# EasyEDA schematic Skematic.json
TITLE: DIGITAL_CLOCK (GIFT); REV: 1.0; Date: 2025-07-25; Sheet: 1/1; Drawn By: TONY HUYNH TRAN; Company: TONY COOPERATION
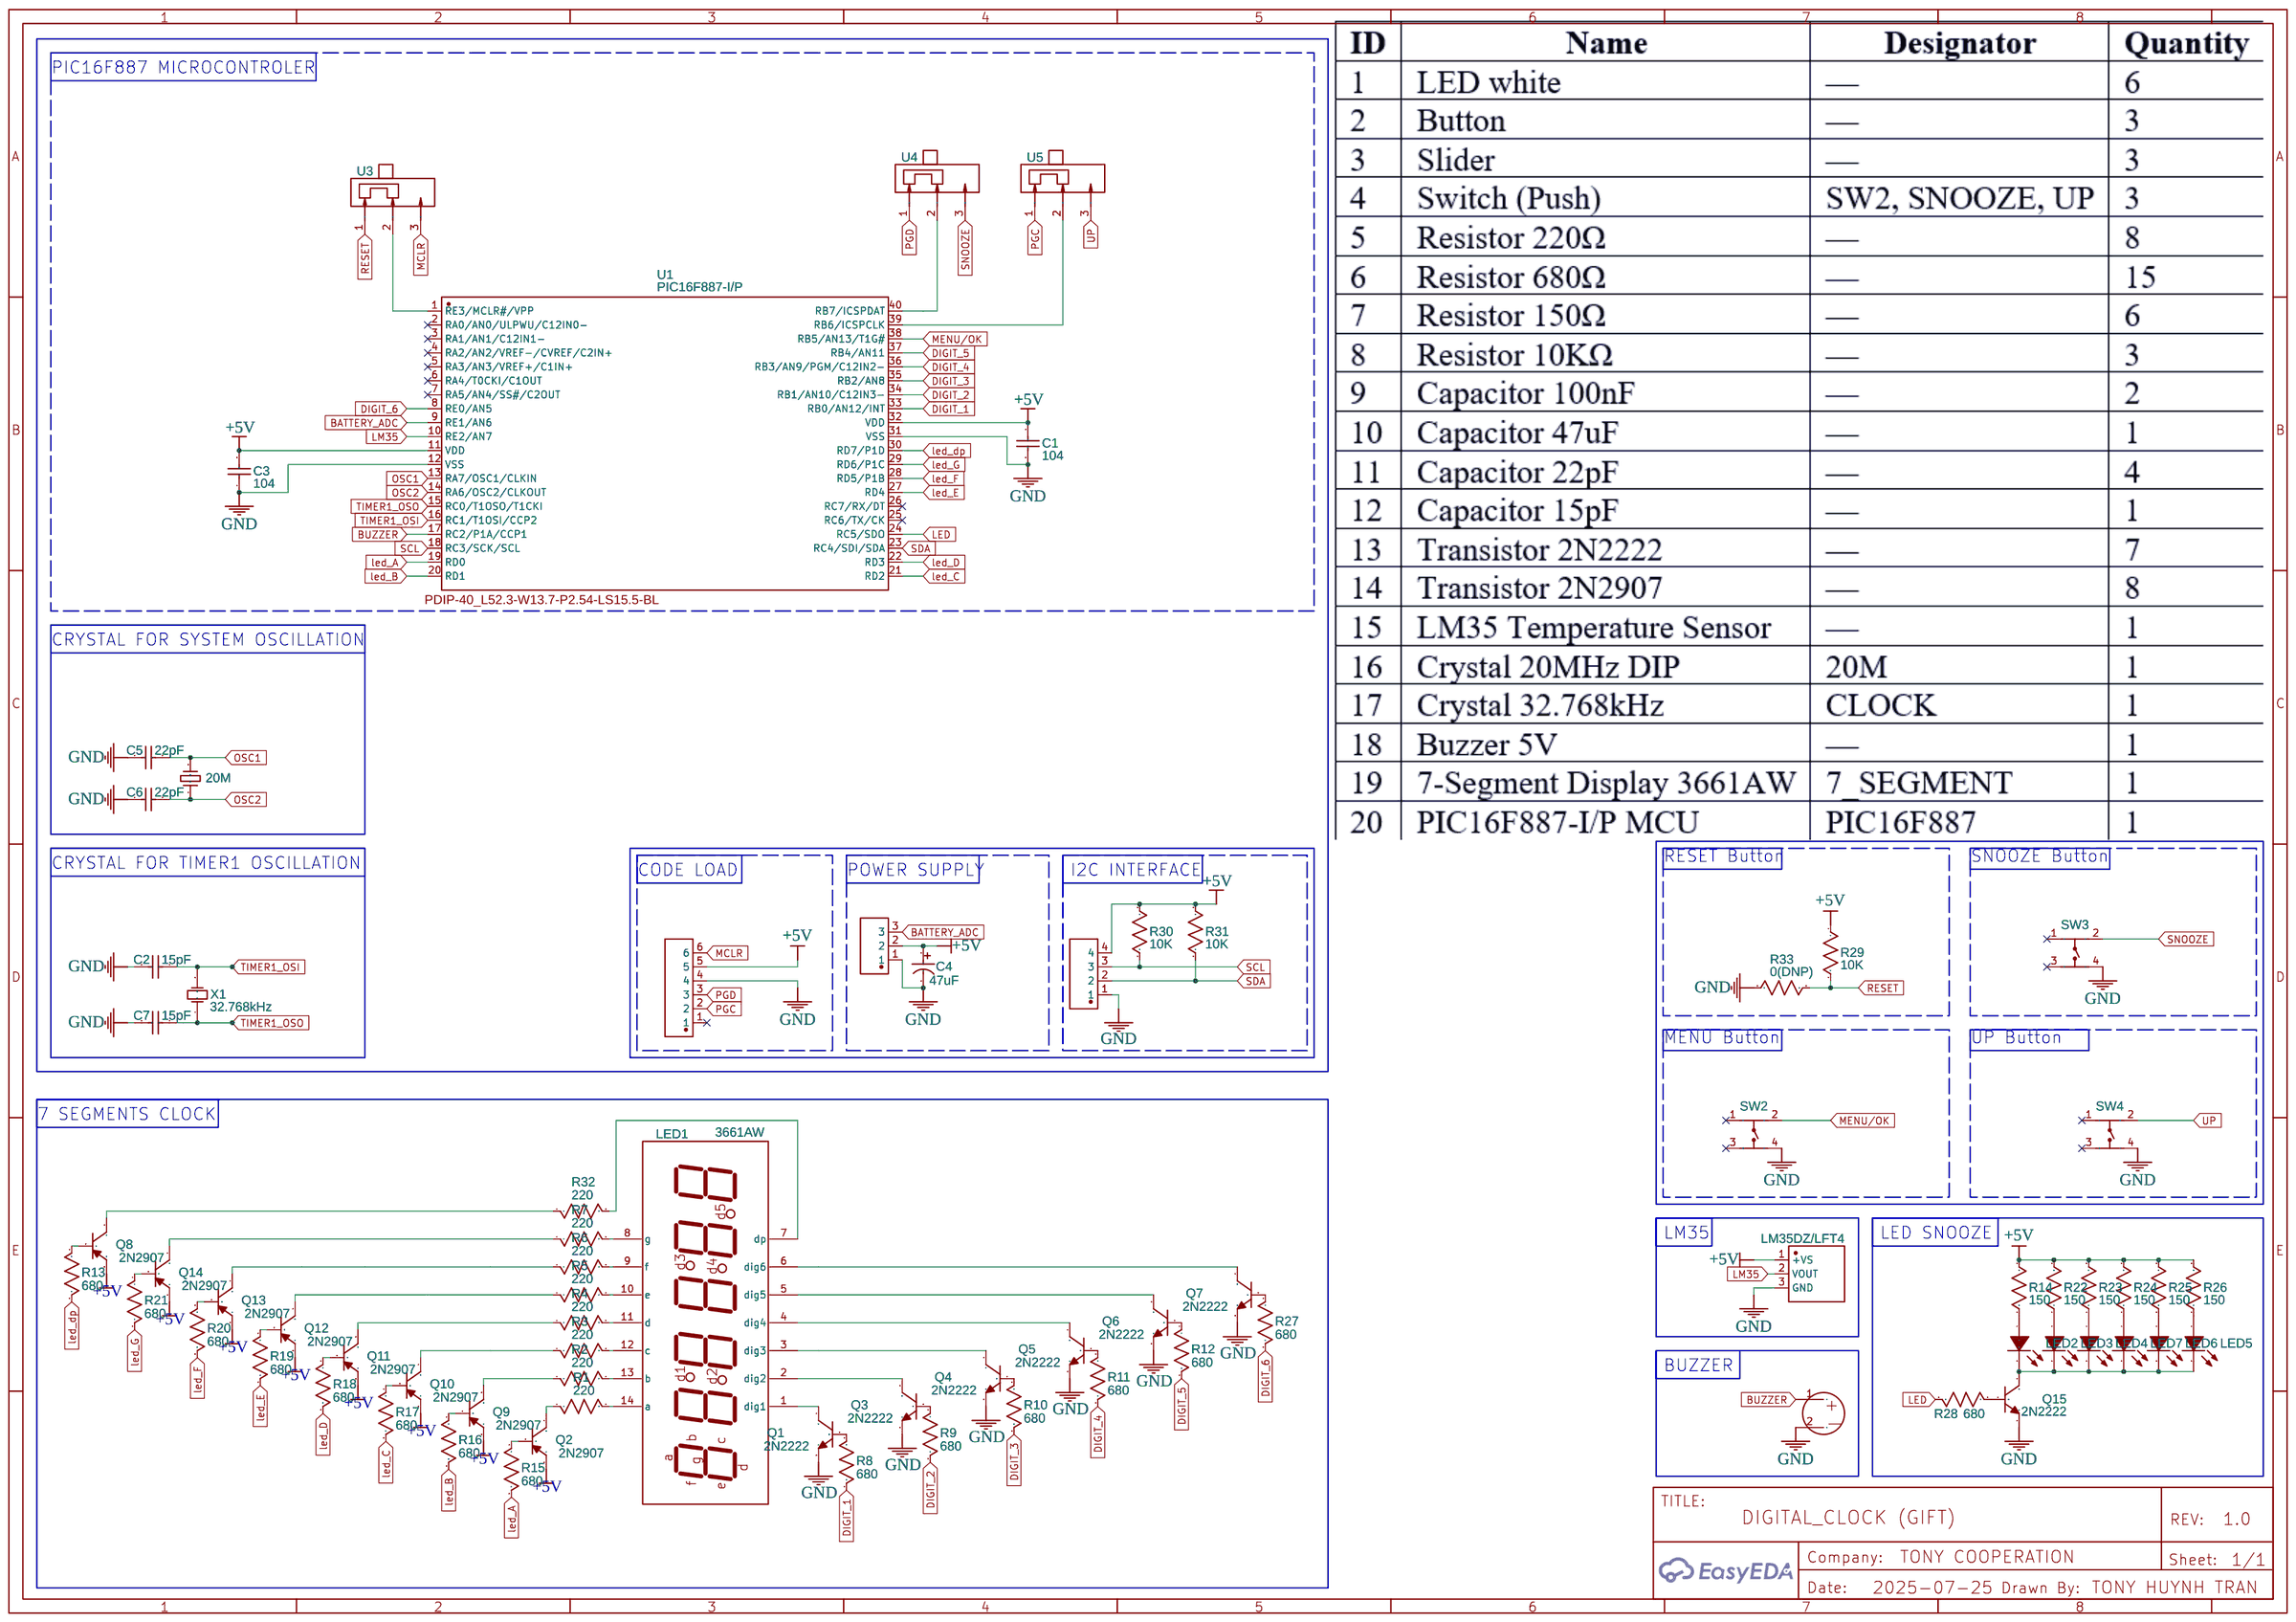
[diagram p0: schematic sheet]

## Parts
20M  Crystal DIP 5.08mm  [CRYSTAL_DIP_5.08MM]
C1  104  [NP CAP-8*3.5-5.08MM]
C2  15pF  [RAD-0.1]
C3  104  [NP CAP-8*3.5-5.08MM]
C4  47uF  [16V 47UF]
C5  22pF  [RAD-0.1]
C6  22pF  [RAD-0.1]
C7  15pF  [RAD-0.1]
H1  HC-PZ200-8.7L-1X4PZ  [CONN-TH_HC-PZ200-8.7L-1X4PZ]
H2  HX PZ1.27-1X6P WZ  [HDR-TH_6P_HXPZ1.27-1X6PWZ]
H3  HX PZ2.0-1X3P WZ-AM  [HDR-TH_HX-PZ2.0-1X3P-WZ-AM]
LED1  3661AW  [3661A_CLK1]
LED2  LED-TH-5mm_R  [LED-TH_BD5.0_RED]
LED3  LED-TH-5mm_R  [LED-TH_BD5.0_RED]
LED4  LED-TH-5mm_R  [LED-TH_BD5.0_RED]
LED5  LED-TH-5mm_R  [LED-TH_BD5.0_RED]
LED6  LED-TH-5mm_R  [LED-TH_BD5.0_RED]
LED7  LED-TH-5mm_R  [LED-TH_BD5.0_RED]
Q1  2N2222  [TO-92-3_L4.8-W3.7-P2.54-R]
Q2  2N2907  [TO-92-3_L4.8-W3.7-P2.54-R]
Q3  2N2222  [TO-92-3_L4.8-W3.7-P2.54-R]
Q4  2N2222  [TO-92-3_L4.8-W3.7-P2.54-R]
Q5  2N2222  [TO-92-3_L4.8-W3.7-P2.54-R]
Q6  2N2222  [TO-92-3_L4.8-W3.7-P2.54-R]
Q7  2N2222  [TO-92-3_L4.8-W3.7-P2.54-R]
Q8  2N2907  [TO-92-3_L4.8-W3.7-P2.54-R]
Q9  2N2907  [TO-92-3_L4.8-W3.7-P2.54-R]
Q10  2N2907  [TO-92-3_L4.8-W3.7-P2.54-R]
Q11  2N2907  [TO-92-3_L4.8-W3.7-P2.54-R]
Q12  2N2907  [TO-92-3_L4.8-W3.7-P2.54-R]
Q13  2N2907  [TO-92-3_L4.8-W3.7-P2.54-R]
Q14  2N2907  [TO-92-3_L4.8-W3.7-P2.54-R]
Q15  2N2222  [TO-92-3_L4.8-W3.7-P2.54-R]
R1  220  [R_AXIAL-0.4]
R2  220  [R_AXIAL-0.4]
R3  220  [R_AXIAL-0.4]
R4  220  [R_AXIAL-0.4]
R5  220  [R_AXIAL-0.4]
R6  220  [R_AXIAL-0.4]
R7  220  [R_AXIAL-0.4]
R8  680  [R_AXIAL-0.4]
R9  680  [R_AXIAL-0.4]
R10  680  [R_AXIAL-0.4]
R11  680  [R_AXIAL-0.4]
R12  680  [R_AXIAL-0.4]
R13  680  [R_AXIAL-0.4]
R14  150  [R_AXIAL-0.4]
R15  680  [R_AXIAL-0.4]
R16  680  [R_AXIAL-0.4]
R17  680  [R_AXIAL-0.4]
R18  680  [R_AXIAL-0.4]
R19  680  [R_AXIAL-0.4]
R20  680  [R_AXIAL-0.4]
R21  680  [R_AXIAL-0.4]
R22  150  [R_AXIAL-0.4]
R23  150  [R_AXIAL-0.4]
R24  150  [R_AXIAL-0.4]
R25  150  [R_AXIAL-0.4]
R26  150  [R_AXIAL-0.4]
R27  680  [R_AXIAL-0.4]
R28  680  [R_AXIAL-0.4]
R29  10K  [R_AXIAL-0.4]
R30  10K  [R_AXIAL-0.4]
R31  10K  [R_AXIAL-0.4]
R32  220  [R_AXIAL-0.4]
R33  0(DNP)  [R_AXIAL-0.4]
SW2  1  [SW-TH_4P-L12.0-W12.0-P5.00]
SW3  1  [SW-TH_4P-L12.0-W12.0-P5.00]
SW4  1  [SW-TH_4P-L12.0-W12.0-P5.00]
U1  PIC16F887-I/P  [PDIP-40_L52.3-W13.7-P2.54-LS15.5-BL]
U2  LM35DZ/LFT4  [TO-92-3_L4.9-W3.7-P1.27-L]
U3  SS-12D00-G3  [SW-TH_3P-L8.8-W3.9-P2.50_SS12D00G3]
U4  SS-12D00-G3  [SW-TH_3P-L8.8-W3.9-P2.50_SS12D00G3]
U5  SS-12D00-G3  [SW-TH_3P-L8.8-W3.9-P2.50_SS12D00G3]
U6  Buzzer 12mm x 5mm  [BUZZER 12.5MM * 5MM]
X1  32.768kHz  [OSC-TH_BD2.0-P0.70-D0.3]

## Library data of the parts
20M = Crystal DIP 5.08mm: Contributor: Marek Štafl; Package Display: No
C1 C3 = CAP-104: Supplier: LCSC; Manufacturer: ReliaPro; Manufacturer Part: Suppression Capacitor222M/250V; Supplier Part: C46751; Contributor: aris hartanto; Package Display: No
C2 C5-C7 = 22pF: Voltage: 50V; Tolerance: ±10%; Supplier Part: C9316; Supplier: LCSC; Manufacturer: ReliaPro; Manufacturer Part: 22pf/50V 10%; Package Display: No
C4 = 16V 47UF COPY: Supplier: LCSC; Manufacturer: CX(承兴); Manufacturer Part: KM108M025G17RR0VH2FP0; Supplier Part: C10750; JLCPCB Part Class: Extended Part; Contributor: INSPIRE INDIA INSTITUTE; Package Display: No
H1 = HC-PZ200-8.7L-1X4PZ: Supplier: LCSC; Supplier Part: C27985153; Manufacturer: HC(虹成电子); Manufacturer Part: HC-PZ200-8.7L-1x4PZ; JLCPCB Part Class: Extended Part; Contributor: lcsc; Package Display: No
H2 = HX PZ1.27-1X6P WZ: Supplier: LCSC; Supplier Part: C22438192; Manufacturer: hanxia(韩下); Manufacturer Part: HX PZ1.27-1x6P WZ; JLCPCB Part Class: Extended Part; Contributor: lcsc; Package Display: No
H3 = HX PZ2.0-1X3P WZ-AM: Supplier: LCSC; Supplier Part: C22438127; Manufacturer: hanxia(韩下); Manufacturer Part: HX PZ2.0-1x3P WZ-AM; JLCPCB Part Class: Extended Part; Contributor: lcsc; Package Display: No
LED1 = 3661A_CLK: Manufacturer: CLee LED Store; JLCPCB Part Class: Extended Part; link: https://ko.aliexpress.com/item/1005003747318364.html?spm=a2g0o.store_pc_groupList.8148356.13.2ff73fabOnnanB&pdp_npi=2%40dis%21KRW%21%E2%82%A9%201%2C992%21%E2%82%A9%201%2C758%21%21%21%21%21%402101e9ce16549364396862674e4a53%2112000027025405278%21sh; Contributor: ModeunIT; Package Display: No
LED2-LED7 = LED-TH-5mm_R: Manufacturer: EVERLIGHT(台湾亿光); Manufacturer Part: 333-2SURD/S530-A3; Supplier Part: C87271; Supplier: LCSC; Contributor: LCEDA_Lib; Package Display: No
Q1 Q3-Q7 Q15 = 2N2222A: Contributor: LCSC; Supplier: LCSC; Supplier Part: C358533; Manufacturer: BLUE ROCKET(蓝箭); JLCPCB Part Class: Extended Part; Package Display: No
Q2 Q8-Q14 = 2N2907A: Contributor: LCSC; Supplier: LCSC; Supplier Part: C358534; Manufacturer: BLUE ROCKET(蓝箭); JLCPCB Part Class: Extended Part; Package Display: No
R1-R33 = R_AXIAL-0.4_US: Contributor: LCEDA_Lib; Package Display: No
SW2-SW4 = TS1103S-12X12X10.5DIP: Supplier: LCSC; Supplier Part: C48677988; Manufacturer: CAX(创都); Manufacturer Part: TS1103S-12x12x10.5DIP; Contributor: lcsc; JLCPCB Part Class: Extended Part; Package Display: No
U1 = PIC16F887-I/P: Contributor: LCSC; Supplier: LCSC; Supplier Part: C1337531; Manufacturer: MICROCHIP(美国微芯); JLCPCB Part Class: Extended Part; Package Display: Yes
U2 = LM35DZ/LFT4: Contributor: LCSC; Supplier: LCSC; Supplier Part: C2867997; Manufacturer: TI(德州仪器); JLCPCB Part Class: Extended Part; Package Display: No
U3-U5 = SS-12D00-G3: Supplier: LCSC; Supplier Part: C22355741; Manufacturer: SOFNG(硕方); Contributor: lcsc; JLCPCB Part Class: Extended Part; Package Display: No
U6 = Buzzer 12mm x 5mm: Contributor: oliverkunz; Package Display: No
X1 = Y6OEL89CIC-STUYLC-32.768K: Supplier: LCSC; Supplier Part: C19272780; Manufacturer: YXC(扬兴晶振); JLCPCB Part Class: Extended Part; Contributor: lcsc; Package Display: No

## Nets
+5V: C1.2 C3.2 C4.1 H1.4 H2.5 H3.2 Q2.3(E) Q8.3(E) Q9.3(E) Q10.3(E) Q11.3(E) Q12.3(E) Q13.3(E) Q14.3(E) R14.2 R22.2 R23.2 R24.2 R25.2 R26.2 R29.1 R30.2 R31.2 U1.11(VDD) U1.32(VDD) U2.1(+VS)
GND: C1.1 C2.1 C3.1 C4.2 C5.1 C6.1 C7.1 H1.1 H2.4 H3.1 Q1.3(E) Q3.3(E) Q4.3(E) Q5.3(E) Q6.3(E) Q7.3(E) Q15.3(E) R33.1 SW2.4 SW3.4 SW4.4 U1.12(VSS) U1.31(VSS) U2.3(GND) U6.2
BATTERY_ADC: H3.3 U1.9(RE1/AN6)
BUZZER: U1.17(RC2/P1A/CCP1) U6.1
DIGIT_1: R8.2 U1.33(RB0/AN12/INT)
DIGIT_2: R9.2 U1.34(RB1/AN10/C12IN3-)
DIGIT_3: R10.2 U1.35(RB2/AN8)
DIGIT_4: R11.2 U1.36(RB3/AN9/PGM/C12IN2-)
DIGIT_5: R12.2 U1.37(RB4/AN11)
DIGIT_6: R27.2 U1.8(RE0/AN5)
LED: R28.2 U1.24(RC5/SDO)
led_A: R15.2 U1.19(RD0)
led_B: R16.2 U1.20(RD1)
led_C: R17.2 U1.21(RD2)
led_D: R18.2 U1.22(RD3)
led_dp: R13.2 U1.30(RD7/P1D)
led_E: R19.2 U1.27(RD4)
led_F: R20.2 U1.28(RD5/P1B)
led_G: R21.2 U1.29(RD6/P1C)
LM35: U1.10(RE2/AN7) U2.2(VOUT)
MCLR: H2.6 U3.3
MENU/OK: SW2.2 U1.38(RB5/AN13/T1G#)
OSC1: 20M.1 C5.2 U1.13(RA7/OSC1/CLKIN)
OSC2: 20M.2 C6.2 U1.14(RA6/OSC2/CLKOUT)
PGC: H2.2 U5.1
PGD: H2.3 U4.1
RESET: R29.2 R33.2 U3.1
SCL: H1.3 R30.1 U1.18(RC3/SCK/SCL)
SDA: H1.2 R31.1 U1.23(RC4/SDI/SDA)
SNOOZE: SW3.2 U4.3
TIMER1_OSI: C2.2 U1.16(RC1/T1OSI/CCP2) X1.2(OSC2)
TIMER1_OSO: C7.2 U1.15(RC0/T1OSO/T1CKI) X1.1(OSC1)
UP: SW4.2 U5.3
Net-(LED1-1): LED1.1(dig1) Q1.1(C)
Net-(LED1-2): LED1.2(dig2) Q3.1(C)
Net-(LED1-3): LED1.3(dig3) Q4.1(C)
Net-(LED1-4): LED1.4(dig4) Q5.1(C)
Net-(LED1-5): LED1.5(dig5) Q6.1(C)
Net-(LED1-6): LED1.6(dig6) Q7.1(C)
Net-(LED1-7): LED1.7(dp) R32.2
Net-(LED1-8): LED1.8(g) R7.2
Net-(LED1-9): LED1.9(f) R6.2
Net-(LED1-10): LED1.10(e) R5.2
Net-(LED1-11): LED1.11(d) R4.2
Net-(LED1-12): LED1.12(c) R3.2
Net-(LED1-13): LED1.13(b) R2.2
Net-(LED1-14): LED1.14(a) R1.2
Net-(LED2-1): LED2.1 R14.1
Net-(LED2-2): LED2.2 LED3.2 LED4.2 LED5.2 LED6.2 LED7.2 Q15.1(C)
Net-(LED3-1): LED3.1 R22.1
Net-(LED4-1): LED4.1 R23.1
Net-(LED5-1): LED5.1 R26.1
Net-(LED6-1): LED6.1 R25.1
Net-(LED7-1): LED7.1 R24.1
Net-(Q1-2): Q1.2(B) R8.1
Net-(Q2-1): Q2.1(C) R1.1
Net-(Q2-2): Q2.2(B) R15.1
Net-(Q3-2): Q3.2(B) R9.1
Net-(Q4-2): Q4.2(B) R10.1
Net-(Q5-2): Q5.2(B) R11.1
Net-(Q6-2): Q6.2(B) R12.1
Net-(Q7-2): Q7.2(B) R27.1
Net-(Q8-1): Q8.1(C) R32.1
Net-(Q8-2): Q8.2(B) R13.1
Net-(Q9-1): Q9.1(C) R2.1
Net-(Q9-2): Q9.2(B) R16.1
Net-(Q10-1): Q10.1(C) R3.1
Net-(Q10-2): Q10.2(B) R17.1
Net-(Q11-1): Q11.1(C) R4.1
Net-(Q11-2): Q11.2(B) R18.1
Net-(Q12-1): Q12.1(C) R5.1
Net-(Q12-2): Q12.2(B) R19.1
Net-(Q13-1): Q13.1(C) R6.1
Net-(Q13-2): Q13.2(B) R20.1
Net-(Q14-1): Q14.1(C) R7.1
Net-(Q14-2): Q14.2(B) R21.1
Net-(Q15-2): Q15.2(B) R28.1
Net-(U1-1): U1.1(RE3/MCLR#/VPP) U3.2
Net-(U1-39): U1.39(RB6/ICSPCLK) U5.2
Net-(U1-40): U1.40(RB7/ICSPDAT) U4.2

Not connected (* = marked no-connect by the designer): H2 1*; SW2 1* 3*; SW3 1* 3*; SW4 1* 3*; U1 2(RA0/AN0/ULPWU/C12IN0-)* 3(RA1/AN1/C12IN1-)* 4(RA2/AN2/VREF-/CVREF/C2IN+)* 5(RA3/AN3/VREF+/C1IN+)* 6(RA4/T0CKI/C1OUT)* 7(RA5/AN4/SS#/C2OUT)* 25(RC6/TX/CK)* 26(RC7/RX/DT)*

## Notes on the sheet
- PIC16F887 MICROCONTROLER
- CRYSTAL FOR SYSTEM OSCILLATION
- CRYSTAL FOR TIMER1 OSCILLATION
- RESET Button
- SNOOZE Button
- CODE LOAD
- POWER SUPPLY
- I2C INTERFACE
- MENU Button
- UP Button
- 7 SEGMENTS CLOCK
- LM35
- LED SNOOZE
- BUZZER
